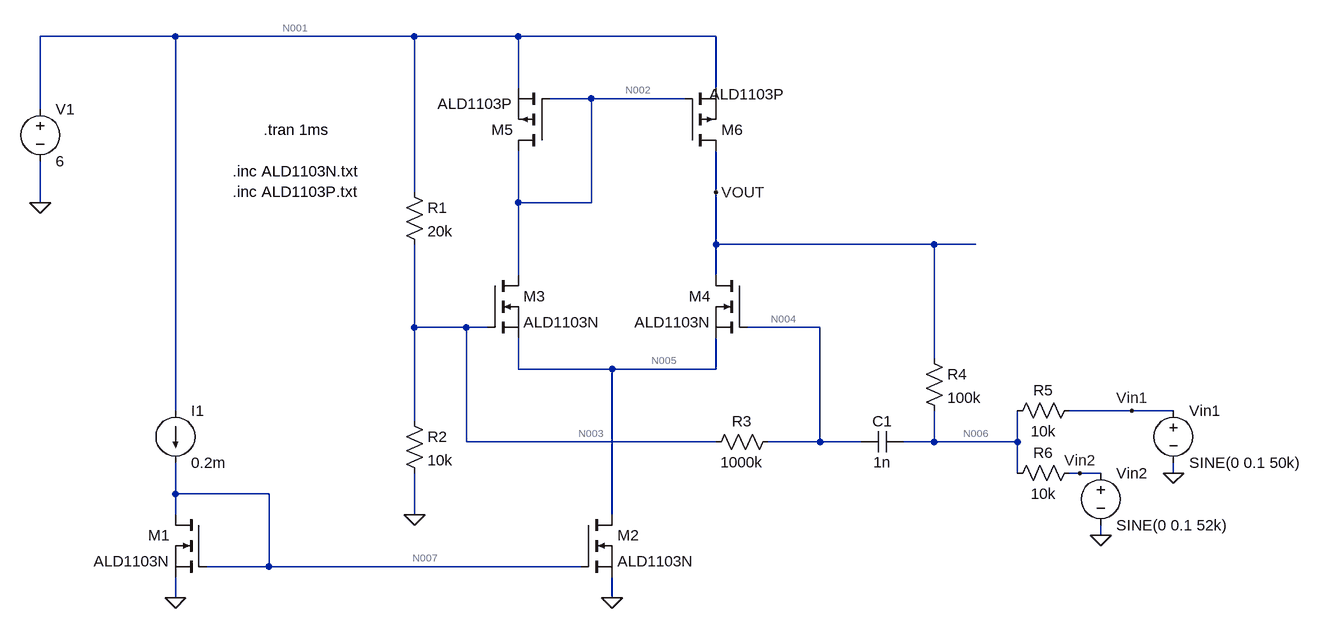
[diagram p0: schematic op_amp.asc]
op_amp.asc, the LTspice schematic file:
Version 4.1
SHEET 1 1460 680
WIRE -288 -656 -496 -656
WIRE 80 -656 -288 -656
WIRE 240 -656 80 -656
WIRE 544 -656 240 -656
WIRE 240 -576 240 -656
WIRE 544 -576 544 -656
WIRE 352 -560 288 -560
WIRE 496 -560 352 -560
WIRE -496 -544 -496 -656
WIRE 80 -416 80 -656
WIRE 544 -416 544 -480
WIRE -496 -400 -496 -464
WIRE 240 -400 240 -480
WIRE 352 -400 352 -560
WIRE 352 -400 240 -400
WIRE 544 -336 544 -416
WIRE 880 -336 544 -336
WIRE 944 -336 880 -336
WIRE 240 -288 240 -400
WIRE 544 -288 544 -336
WIRE 80 -208 80 -336
WIRE 160 -208 80 -208
WIRE 192 -208 160 -208
WIRE 704 -208 592 -208
WIRE 880 -160 880 -336
WIRE 240 -144 240 -192
WIRE 384 -144 240 -144
WIRE 544 -144 544 -192
WIRE 544 -144 384 -144
WIRE -288 -80 -288 -656
WIRE 1184 -80 1088 -80
WIRE 1248 -80 1184 -80
WIRE 80 -64 80 -208
WIRE 160 -32 160 -208
WIRE 544 -32 160 -32
WIRE 704 -32 704 -208
WIRE 704 -32 624 -32
WIRE 768 -32 704 -32
WIRE 880 -32 880 -80
WIRE 880 -32 832 -32
WIRE 1008 -32 1008 -80
WIRE 1008 -32 880 -32
WIRE 1008 16 1008 -32
WIRE 1104 16 1088 16
WIRE 1136 16 1104 16
WIRE 1248 16 1248 0
WIRE -288 48 -288 0
WIRE -144 48 -288 48
WIRE -288 80 -288 48
WIRE 80 80 80 16
WIRE 384 80 384 -144
WIRE 1136 112 1136 96
WIRE -144 160 -144 48
WIRE -144 160 -240 160
WIRE 336 160 -144 160
WIRE -288 208 -288 176
WIRE 384 208 384 176
FLAG -288 208 0
FLAG 384 208 0
FLAG -496 -400 0
FLAG 80 80 0
FLAG 544 -416 VOUT
FLAG 1136 112 0
FLAG 1248 16 0
FLAG 1184 -80 Vin1
FLAG 1104 16 Vin2
SYMBOL nmos -240 80 M0
SYMATTR InstName M1
SYMATTR Value ALD1103N
SYMBOL nmos 336 80 R0
SYMATTR InstName M2
SYMATTR Value ALD1103N
SYMBOL nmos 192 -288 R0
SYMATTR InstName M3
SYMATTR Value ALD1103N
SYMBOL nmos 592 -288 M0
SYMATTR InstName M4
SYMATTR Value ALD1103N
SYMBOL pmos 288 -480 R180
SYMATTR InstName M5
SYMATTR Value ALD1103P
SYMBOL pmos 496 -480 M180
WINDOW 3 38 87 Left 2
SYMATTR Value ALD1103P
SYMATTR InstName M6
SYMBOL current -288 -80 R0
WINDOW 123 0 0 Left 0
WINDOW 39 0 0 Left 0
SYMATTR InstName I1
SYMATTR Value 0.2m
SYMBOL voltage -496 -560 R0
WINDOW 123 0 0 Left 0
WINDOW 39 0 0 Left 0
SYMATTR InstName V1
SYMATTR Value 6
SYMBOL res 64 -432 R0
SYMATTR InstName R1
SYMATTR Value 20k
SYMBOL res 64 -80 R0
SYMATTR InstName R2
SYMATTR Value 10k
SYMBOL res 640 -48 R90
WINDOW 0 0 56 VBottom 2
WINDOW 3 32 56 VTop 2
SYMATTR InstName R3
SYMATTR Value 1000k
SYMBOL cap 832 -48 R90
WINDOW 0 0 32 VBottom 2
WINDOW 3 32 32 VTop 2
SYMATTR InstName C1
SYMATTR Value 1n
SYMBOL res 864 -176 R0
SYMATTR InstName R4
SYMATTR Value 100k
SYMBOL res 1104 -96 R90
WINDOW 0 0 56 VBottom 2
WINDOW 3 32 56 VTop 2
SYMATTR InstName R5
SYMATTR Value 10k
SYMBOL res 1104 0 R90
WINDOW 0 0 56 VBottom 2
WINDOW 3 32 56 VTop 2
SYMATTR InstName R6
SYMATTR Value 10k
SYMBOL voltage 1136 0 R0
WINDOW 123 0 0 Left 0
WINDOW 39 0 0 Left 0
SYMATTR InstName Vin2
SYMATTR Value SINE(0 0.1 52k)
SYMBOL voltage 1248 -96 R0
WINDOW 123 0 0 Left 0
WINDOW 39 0 0 Left 0
SYMATTR InstName Vin1
SYMATTR Value SINE(0 0.1 50k)
TEXT -200 -448 Left 2 !.inc ALD1103N.txt\n.inc ALD1103P.txt
TEXT -152 -512 Left 2 !.tran 1ms

The netlist it stands for:
* op_amp.asc
M1 N007 N007 0 0 ALD1103N
M2 N005 N007 0 0 ALD1103N
M3 N002 N003 N005 N005 ALD1103N
M4 VOUT N004 N005 N005 ALD1103N
M5 N002 N002 N001 N001 ALD1103P
M6 VOUT N002 N001 N001 ALD1103P
I1 N001 N007 0.2m
V1 N001 0 6
R1 N001 N003 20k
R2 N003 0 10k
R3 N004 N003 1000k
C1 N006 N004 1n
R4 VOUT N006 100k
R5 Vin1 N006 10k
R6 Vin2 N006 10k
Vin2 Vin2 0 SINE(0 0.1 52k)
Vin1 Vin1 0 SINE(0 0.1 50k)
.model NMOS NMOS
.model PMOS PMOS
.lib standard.mos
.inc ALD1103N.txt
.inc ALD1103P.txt
.tran 1ms
.backanno
.end

* Results of the author's LTspice run, read from the files saved beside the schematic
* Operating Point, zero values left out:
*   V(n005) = 1.179 V
*   V(n003) = 2 V
*   V(vout) = 3.05 V
*   V(n001) = 6 V
*   V(n007) = 897.9 mV
*   V(n002) = 5.079 V
*   V(n004) = 2 V
*   V(n006) = 145.2 mV
*   Id(M1) = 200 µA
*   Is(M1) = -200 µA
*   Id(M5) = -110.2 µA
*   Is(M5) = 110.2 µA
*   Id(M6) = -122.2 µA
*   Is(M6) = 122.2 µA
*   Ib(M6) = 2.96 pA
*   I(V1) = -632.3 µA
*   I(R4) = 29.04 µA
*   I(R5) = -14.52 µA
*   Id(M3) = 110.2 µA
*   Is(M3) = -110.2 µA
*   Ib(M3) = -3.91 pA
*   I(Vin2) = 14.52 µA
*   Id(M4) = 93.13 µA
*   Is(M4) = -93.13 µA
*   Ib(M4) = -1.881 pA
*   I(I1) = 200 µA
*   I(R2) = 200 µA
*   I(R6) = -14.52 µA
*   I(Vin1) = 14.52 µA
*   Id(M2) = 203.3 µA
*   Is(M2) = -203.3 µA
*   Ib(M2) = -1.189 pA
*   I(R1) = 200 µA
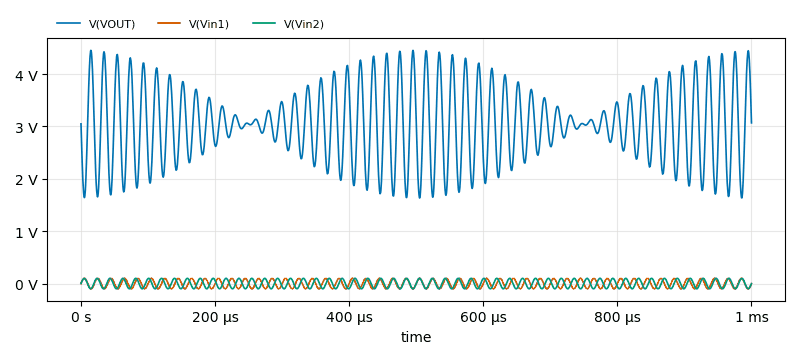
[diagram p1: Transient Analysis of op_amp.asc, plotted from the saved traces]
* Transient Analysis, 1 run:
*   V(VOUT): min 1.633 V, max 4.453 V, average 3.042 V, rms 3.124 V, last 3.068 V
*   V(Vin1): min -100 mV, max 100 mV, average 31.32 µV, rms 70.81 mV, last 0 V
*   V(Vin2): min -100 mV, max 100 mV, average 32.49 µV, rms 70.82 mV, last 0 V